# Altium schematic sheet Main.SchDoc
size 549 x 549 mm
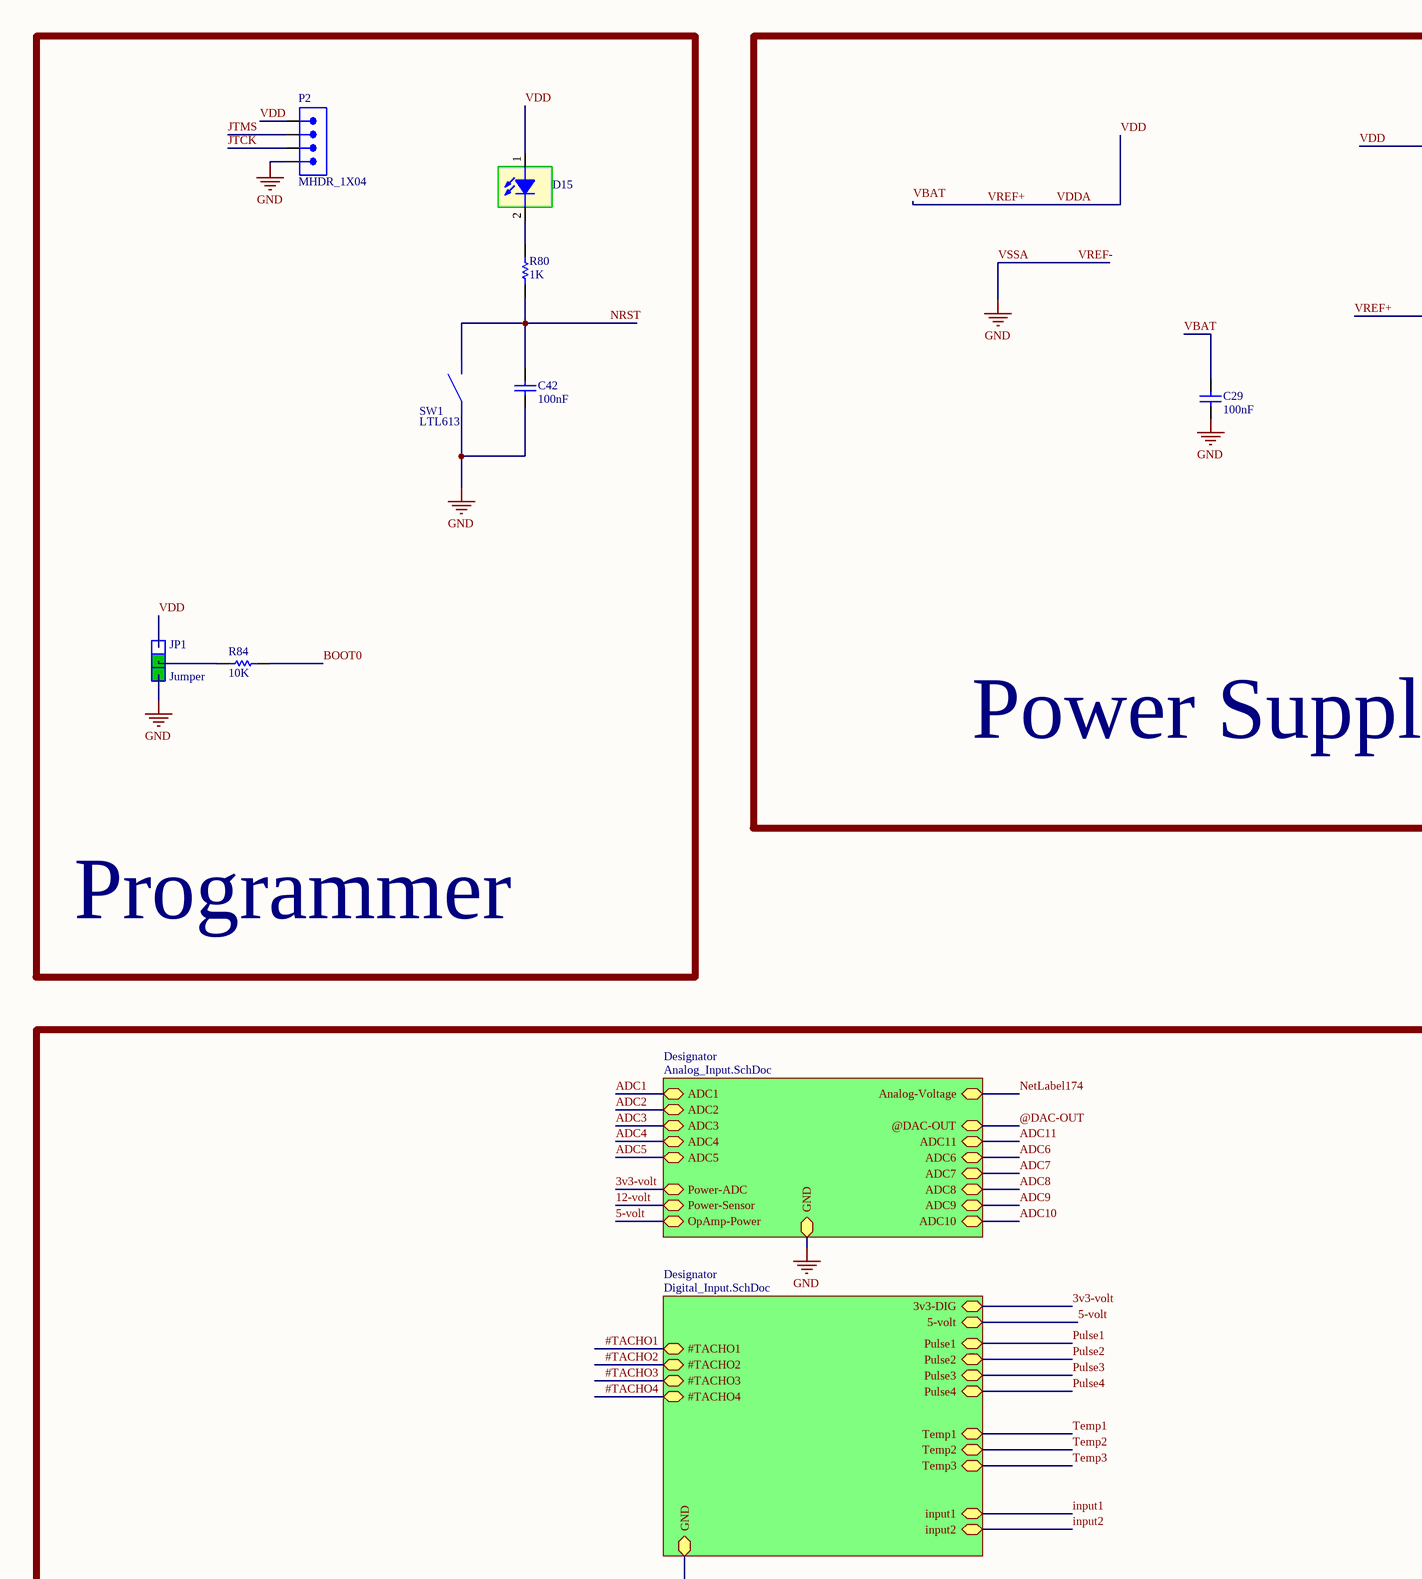
[diagram p0: Main.SchDoc, top left]
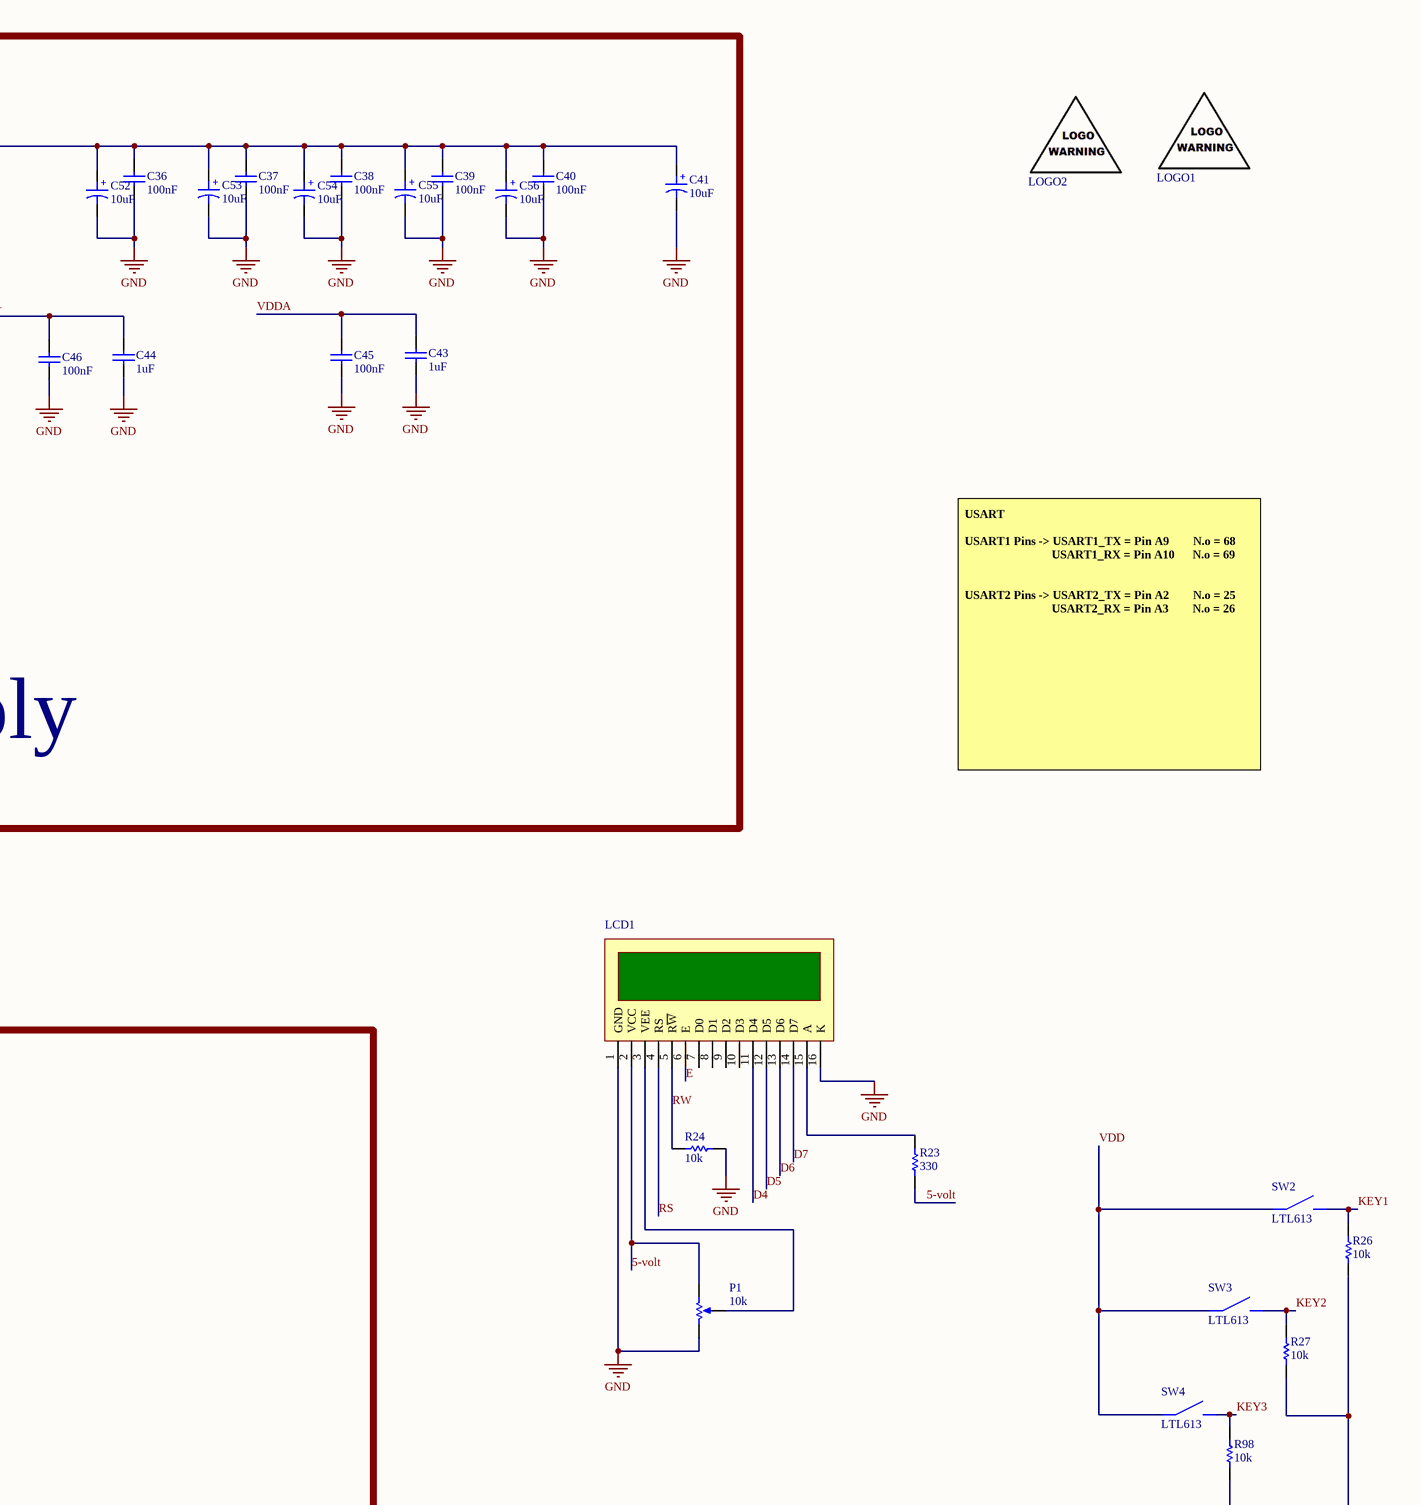
[diagram p1: Main.SchDoc, top right]
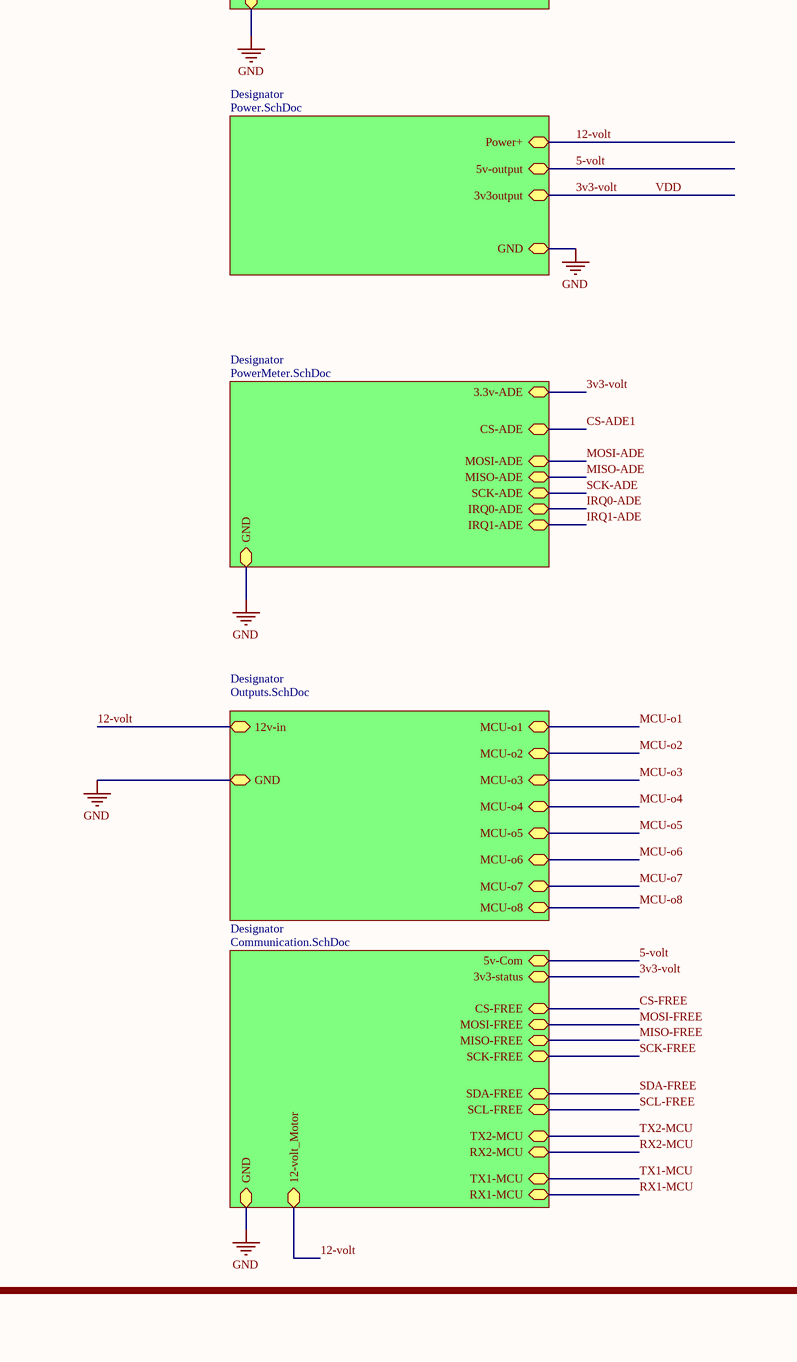
[diagram p2: Main.SchDoc, bottom left]
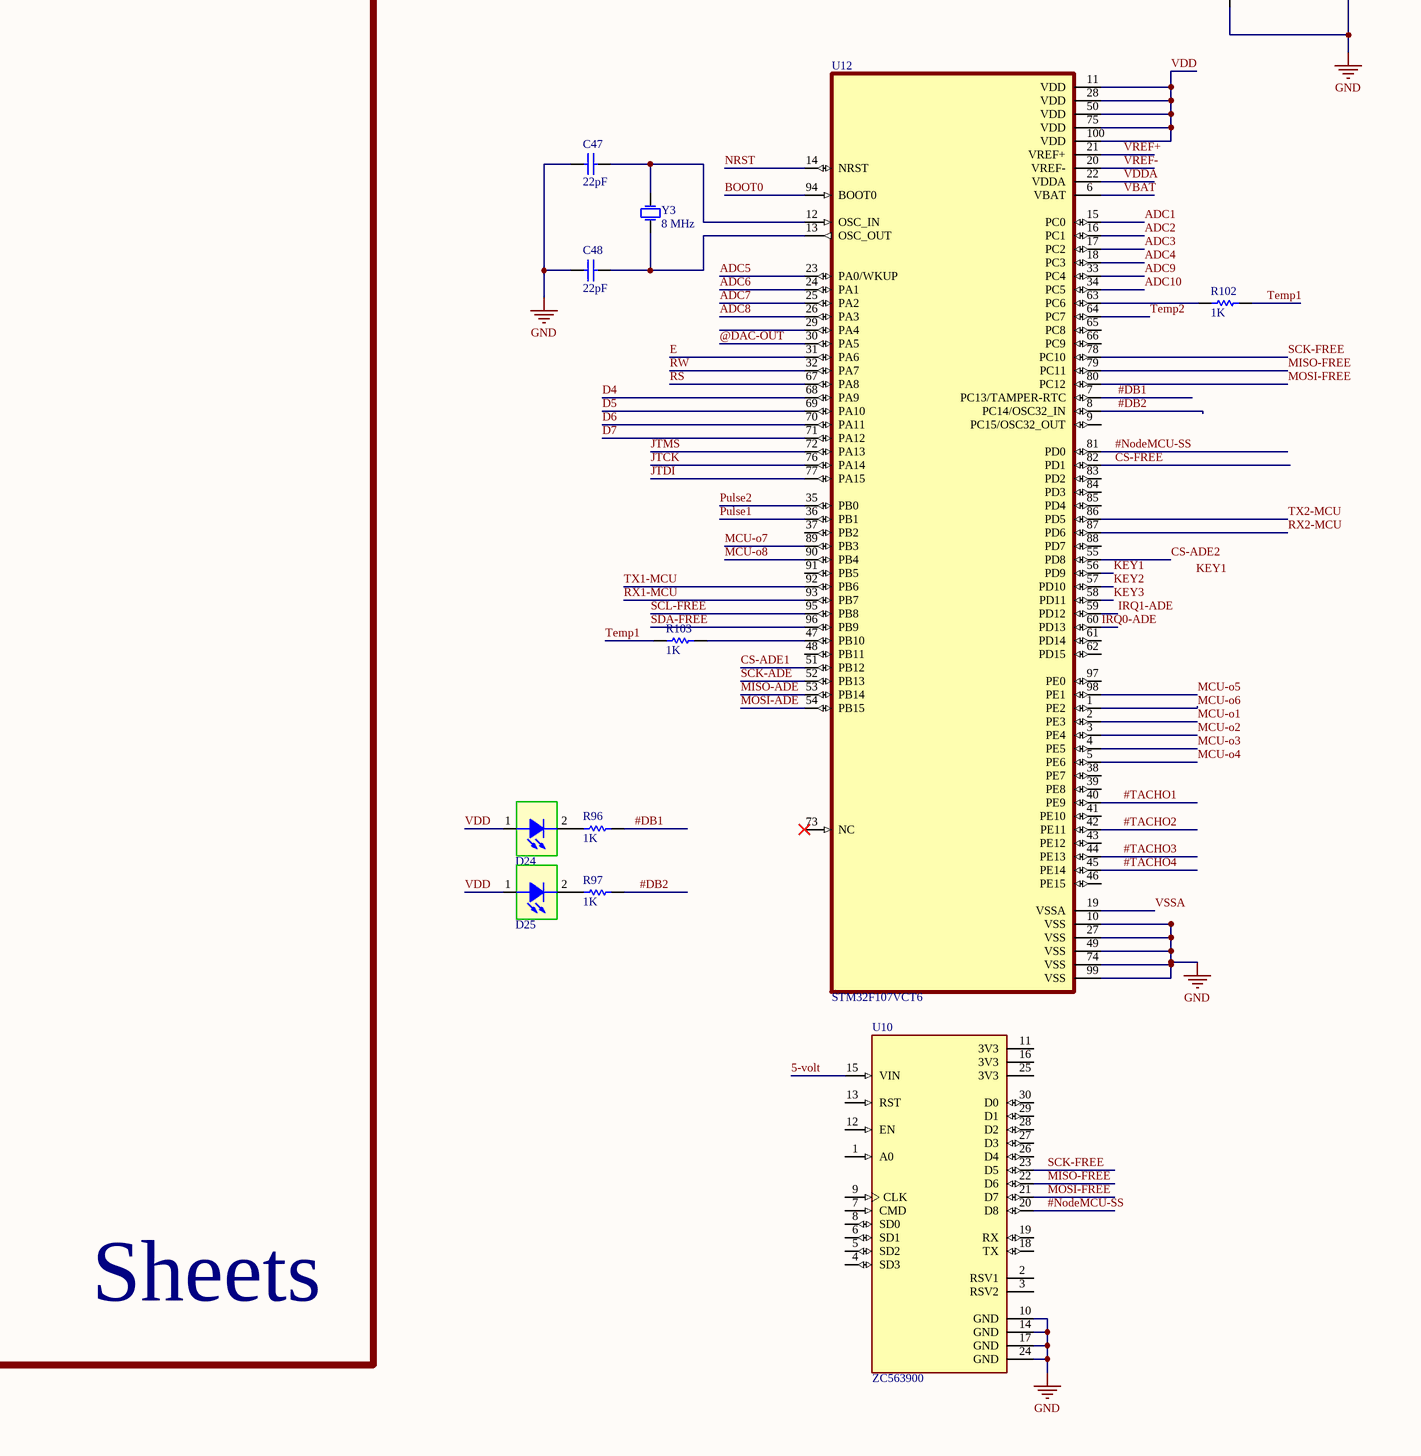
[diagram p3: Main.SchDoc, bottom right]

## Parts
C29  100nF  [0805_C]
C36  100nF  [0805_C]
C37  100nF  [0805_C]
C38  100nF  [0805_C]
C39  100nF  [0805_C]
C40  100nF  [0805_C]
C41  10uF  [Cap1206_(3216X18L)Size A]
C42  100nF  [0805_C]
C43  1uF  [0805_C]
C44  1uF  [0805_C]
C45  100nF  [0805_C]
C46  100nF  [0805_C]
C47  22pF  [CAPC3413X12N]
C48  22pF  [CAPC3413X12N]
C52  10uF  [Cap1206_(3216X18L)Size A]
C53  10uF  [Cap1206_(3216X18L)Size A]
C54  10uF  [Cap1206_(3216X18L)Size A]
C55  10uF  [Cap1206_(3216X18L)Size A]
C56  10uF  [Cap1206_(3216X18L)Size A]
D15  SMD 1206 LED  [LED 1206]  (value not drawn)
D24  SMD 1206 LED  [LED 1206]  (value not drawn)
D25  SMD 1206 LED  [LED 1206]  (value not drawn)
JP1  Jumper  [jumper selector]
LCD1  LCD2x16  [LCD 2*16]  (value not drawn)
LOGO1  (no value)  [WARNING ESD]  (no BOM)
LOGO2  (no value)  [WARNING]  (no BOM)
P1  10k  [Multi-Turn]
P2  MHDR_1X04  [MHDR1X04-254P]
R23  330  [RESC3413X04N]
R24  10k  [RESC3413X04N]
R26  10k  [RESC3413X04N]
R27  10k  [RESC3413X04N]
R80  1K  [RESC3413X04N]
R84  10K  [RESC3413X04N]
R96  1K  [RESC3413X04N]
R97  1K  [RESC3413X04N]
R98  10k  [RESC3413X04N]
R102  1K  [RESC3413X04N]
R103  1K  [RESC3413X04N]
SW1  LTL613  [pb-kfc-3x6x5]
SW2  LTL613  [LTL613]
SW3  LTL613  [LTL613]
SW4  LTL613  [LTL613]
U10  ZC563900  [MODULE_ZC563900]
U12  STM32F107VCT6  [QFP50P1600X1600X160-100N]
Y3  8 MHz  [Crystal SMD]

## Blocks framed on the sheet
Programmer: C42 D15 JP1 P2 R80 R84 SW1
Power Supply: C29 C36-C41 C43-C46 C52-C56

## Sub-sheets
Designator = PowerMeter.SchDoc: 3.3v-ADE (bidir), CS-ADE (bidir), MOSI-ADE (bidir), MISO-ADE (bidir), SCK-ADE (bidir), GND (bidir), IRQ0-ADE (bidir), IRQ1-ADE (bidir)
Designator = Outputs.SchDoc: MCU-o1 (bidir), MCU-o2 (bidir), MCU-o4 (bidir), MCU-o5 (bidir), MCU-o6 (bidir), MCU-o7 (bidir), 12v-in (bidir), GND (bidir), MCU-o3 (bidir), MCU-o8 (bidir)
Designator = Analog_Input.SchDoc: ADC1 (bidir), ADC2 (bidir), ADC3 (bidir), ADC4 (bidir), ADC5 (bidir), GND (bidir), Analog-Voltage (bidir), ADC10 (bidir), ADC9 (bidir), ADC8 (bidir), ADC7 (bidir), ADC6 (bidir), ADC11 (bidir), OpAmp-Power (bidir), Power-Sensor (bidir), Power-ADC (bidir), @DAC-OUT (bidir)
Designator = Digital_Input.SchDoc: Pulse1 (bidir), Pulse2 (bidir), Pulse3 (bidir), Pulse4 (bidir), Temp1 (bidir), Temp2 (bidir), Temp3 (bidir), input1 (bidir), input2 (bidir), GND (bidir), 3v3-DIG (bidir), 5-volt (bidir), #TACHO1 (bidir), #TACHO2 (bidir), #TACHO3 (bidir), #TACHO4 (bidir)
Designator = Power.SchDoc: Power+ (bidir), 5v-output (bidir), 3v3output (bidir), GND (bidir)
Designator = Communication.SchDoc: 5v-Com (bidir), RX1-MCU (bidir), TX1-MCU (bidir), RX2-MCU (bidir), TX2-MCU (bidir), SCK-FREE (bidir), MISO-FREE (bidir), MOSI-FREE (bidir), CS-FREE (bidir), SCL-FREE (bidir), SDA-FREE (bidir), GND (bidir), 3v3-status (bidir), 12-volt_Motor (bidir)

## Nets
VREF-: C29.1 C36.1 C37.1 C38.1 C39.1 C40.1 C41.2 C42.1 C43.1 C44.1 C45.1 C46.1 C47.2 C48.2 C52.2 C53.2 C54.2 C55.2 C56.2 JP1.1 LCD1.1(GND) LCD1.16(K) P1.3(BOT) P2.4 R24.2 R26.1 R27.1 R98.1 SW1.0 U10.10(GND) U10.14(GND) U10.17(GND) U10.24(GND) U12.10(VSS) U12.19(VSSA) U12.20(VREF-) U12.27(VSS) U12.49(VSS) U12.74(VSS) U12.99(VSS) ; sheet Designator/GND, sheet Designator/GND, sheet Designator/GND, sheet Designator/GND, sheet Designator/GND, sheet Designator/GND  [also labelled GND, VSSA]
3v3-volt: C29.2 C36.2 C37.2 C38.2 C39.2 C40.2 C41.1 C43.2 C44.2 C45.2 C46.2 C52.1 C53.1 C54.1 C55.1 C56.1 D15.1 D24.1 D25.1 JP1.3 P2.1 SW2.2 SW3.2 SW4.2 U12.6(VBAT) U12.11(VDD) U12.21(VREF+) U12.22(VDDA) U12.28(VDD) U12.50(VDD) U12.75(VDD) U12.100(VDD) ; sheet Designator/3.3v-ADE, sheet Designator/Power-ADC, sheet Designator/3v3-DIG, sheet Designator/3v3output, sheet Designator/3v3-status  [also labelled VBAT, VDD, VDDA, VREF+]
5-volt: LCD1.2(VCC) P1.1(TOP) R23.2 U10.15(VIN) ; sheet Designator/OpAmp-Power, sheet Designator/5-volt, sheet Designator/5v-output, sheet Designator/5v-Com
12-volt: sheet Designator/12v-in, sheet Designator/Power-Sensor, sheet Designator/Power+, sheet Designator/12-volt_Motor
#DB1: R96.1 U12.7(PC13/TAMPER-RTC)
#DB2: R97.1 U12.8(PC14/OSC32_IN)
#NodeMCU-SS: U10.20(D8) U12.81(PD0)
#TACHO1: U12.40(PE9) ; sheet Designator/#TACHO1
#TACHO2: U12.42(PE11) ; sheet Designator/#TACHO2
#TACHO3: U12.44(PE13) ; sheet Designator/#TACHO3
#TACHO4: U12.45(PE14) ; sheet Designator/#TACHO4
@DAC-OUT: U12.30(PA5) ; sheet Designator/@DAC-OUT
ADC1: U12.15(PC0) ; sheet Designator/ADC1
ADC2: U12.16(PC1) ; sheet Designator/ADC2
ADC3: U12.17(PC2) ; sheet Designator/ADC3
ADC4: U12.18(PC3) ; sheet Designator/ADC4
ADC5: U12.23(PA0/WKUP) ; sheet Designator/ADC5
ADC6: U12.24(PA1) ; sheet Designator/ADC6
ADC7: U12.25(PA2) ; sheet Designator/ADC7
ADC8: U12.26(PA3) ; sheet Designator/ADC8
ADC9: U12.33(PC4) ; sheet Designator/ADC9
ADC10: U12.34(PC5) ; sheet Designator/ADC10
ADC11: sheet Designator/ADC11
BOOT0: R84.2 U12.94(BOOT0)
CS-ADE1: U12.51(PB12) ; sheet Designator/CS-ADE
CS-ADE2: U12.55(PD8)
CS-FREE: U12.82(PD1) ; sheet Designator/CS-FREE
D4: LCD1.11(D4) U12.68(PA9)
D5: LCD1.12(D5) U12.69(PA10)
D6: LCD1.13(D6) U12.70(PA11)
D7: LCD1.14(D7) U12.71(PA12)
E: LCD1.6(E) U12.31(PA6)
input1: sheet Designator/input1
input2: sheet Designator/input2
IRQ0-ADE: U12.60(PD13) ; sheet Designator/IRQ0-ADE
IRQ1-ADE: U12.59(PD12) ; sheet Designator/IRQ1-ADE
JTCK: P2.3 U12.76(PA14)
JTDI: U12.77(PA15)
JTMS: P2.2 U12.72(PA13)
KEY1: R26.2 SW2.1 U12.56(PD9)
KEY2: R27.2 SW3.1 U12.57(PD10)
KEY3: R98.2 SW4.1 U12.58(PD11)
MCU-o1: U12.2(PE3) ; sheet Designator/MCU-o1
MCU-o2: U12.3(PE4) ; sheet Designator/MCU-o2
MCU-o3: U12.4(PE5) ; sheet Designator/MCU-o3
MCU-o4: U12.5(PE6) ; sheet Designator/MCU-o4
MCU-o5: U12.98(PE1) ; sheet Designator/MCU-o5
MCU-o6: U12.1(PE2) ; sheet Designator/MCU-o6
MCU-o7: U12.89(PB3) ; sheet Designator/MCU-o7
MCU-o8: U12.90(PB4) ; sheet Designator/MCU-o8
MISO-ADE: U12.53(PB14) ; sheet Designator/MISO-ADE
MISO-FREE: U10.22(D6) U12.79(PC11) ; sheet Designator/MISO-FREE
MOSI-ADE: U12.54(PB15) ; sheet Designator/MOSI-ADE
MOSI-FREE: U10.21(D7) U12.80(PC12) ; sheet Designator/MOSI-FREE
NetLabel174: sheet Designator/Analog-Voltage
NRST: C42.2 R80.1 SW1.1 U12.14(NRST)
Pulse1: U12.36(PB1) ; sheet Designator/Pulse1
Pulse2: U12.35(PB0) ; sheet Designator/Pulse2
Pulse3: sheet Designator/Pulse3
Pulse4: sheet Designator/Pulse4
RS: LCD1.4(RS) U12.67(PA8)
RW: LCD1.5(R~{W}) R24.1 U12.32(PA7)
RX1-MCU: U12.93(PB7) ; sheet Designator/RX1-MCU
RX2-MCU: U12.87(PD6) ; sheet Designator/RX2-MCU
SCK-ADE: U12.52(PB13) ; sheet Designator/SCK-ADE
SCK-FREE: U10.23(D5) U12.78(PC10) ; sheet Designator/SCK-FREE
SCL-FREE: U12.95(PB8) ; sheet Designator/SCL-FREE
SDA-FREE: U12.96(PB9) ; sheet Designator/SDA-FREE
Temp1: R102.1 R103.1 ; sheet Designator/Temp1
Temp2: U12.64(PC7) ; sheet Designator/Temp2
Temp3: sheet Designator/Temp3
TX1-MCU: U12.92(PB6) ; sheet Designator/TX1-MCU
TX2-MCU: U12.86(PD5) ; sheet Designator/TX2-MCU
NetC47_1: C47.1 U12.12(OSC_IN) Y3.2(OSC2)
NetC48_1: C48.1 U12.13(OSC_OUT) Y3.1(OSC1)
NetD15_2: D15.2 R80.2
NetD24_2: D24.2 R96.2
NetD25_2: D25.2 R97.2
NetJP1_2: JP1.2 R84.1
NetLCD1_3: LCD1.3(VEE) P1.2(TAP)
NetLCD1_15: LCD1.15(A) R23.1
NetR102_2: R102.2 U12.63(PC6)
NetR103_2: R103.2 U12.47(PB10)

Not connected (* = marked no-connect by the designer): LCD1 7(D0) 8(D1) 9(D2) 10(D3); U10 1(A0) 2(RSV1) 3(RSV2) 4(SD3) 5(SD2) 6(SD1) 7(CMD) 8(SD0) 9(CLK) 11(3V3) 12(EN) 13(RST) 16(3V3) 18(TX) 19(RX) 25(3V3) 26(D4) 27(D3) 28(D2) 29(D1) 30(D0); U12 9(PC15/OSC32_OUT) 29(PA4) 37(PB2) 38(PE7) 39(PE8) 41(PE10) 43(PE12) 46(PE15) 48(PB11) 61(PD14) 62(PD15) 65(PC8) 66(PC9) 73(NC)* 83(PD2) 84(PD3) 85(PD4) 88(PD7) 91(PB5) 97(PE0)

## Notes on the sheet
- USART
  USART1 Pins -> USART1_TX = Pin A9        N.o = 68
  USART1_RX = Pin A10      N.o = 69
  USART2 Pins -> USART2_TX = Pin A2        N.o = 25
  USART2_RX = Pin A3        N.o = 26
- Sheets
- Labels drawn without touching a wire or pin: KEY1
- (in symbol Cap ELECTROLITIC TOTAL SIZE) +

## Library data of the parts
C29 C36-C40 C42 C45-C48 = CAP SMD 0805: CAP 0805; Designer: Abbas Basereh; Desc.: CAP SMD 0805; Data: 16-12-2016
C41 C52-C56 = Cap ELECTROLITIC TOTAL SIZE: Cap electrolitic radial; Designer: Abbas Basereh; VALUE: 1uF; Data: 16-12-2016; Part. No: *
C43 C44 = CAP SMD 1206: CAP 1206; Designer: Abbas Basereh; Desc.: CAP SMD 1206; Data: 16-12-2016
D15 D24 D25 = LED SMD 1206
JP1 = Jumper Selector
LOGO1 LOGO2 = Graphical_WARNINGS: WARNING & LOGO; Company: SJ Libraries; Designer: Eng. Saeid Jorablo; Mounting Technology: Surface Mount\Through-Hole; ComponentLink1Description: Datasheet; Pin Count: 0; Update Date: 6/3/2012; Category: MISC; HelpURL: http://s3.picofile.com/file/7443264187/Coming_Soon_logo.gif
P1 = Multi-Turn: Potentiometer
P2 = MHDR_1X04: Male Header 1X04
R23 R24 R26 R27 R80 R84 R96-R98 R102 R103 = RES 0805 0.125W: RES 0805; Designer: Abbas Basereh; Desc.: RES SMD 0805; Data: 16-12-2016
SW1-SW4 = Button_tact: Tact button switch
U10 = ZC563900: NodeMcu Lua ESP8266 WIFI Internet of Things Network Development Module Board; MF: YKS; MP: ZC563900; Package: None; Price: None; Availability: Unavailable; Value: *; SnapEDA_Link: https://www.snapeda.com/parts/ZC563900/YKS/view-part/607853/?ref=snap
U12 = STM32F107VCT6: ARMÂ® CortexÂ®-M3 STM32F1 Microcontroller IC 32-Bit 72MHz 256KB _256K x 8_ FLASH; MF: STMicroelectronics; Package: LQFP-100 STMicroelectronics; Value: *; Price: None; MP: STM32F107VCT6; SnapEDA_Link: https://www.snapeda.com/parts/STM32F107VCT6/STMicroelectronics/view-part/46316/?ref=snap; Availability: Unavailable
Y3 = XTAL: XTAL Crystal; Designer: ABBAS BASEREH; Value: 12 MHz; Design Date: 2017-1-3; ComponentLink1Description: Datasheet; ComponentLink2Description: Reference; Mounting Technology: Surface Mount\Through-Hole; Status: Unreleased